# EAGLE design de1_breakout (EAGLE 6.5.0)
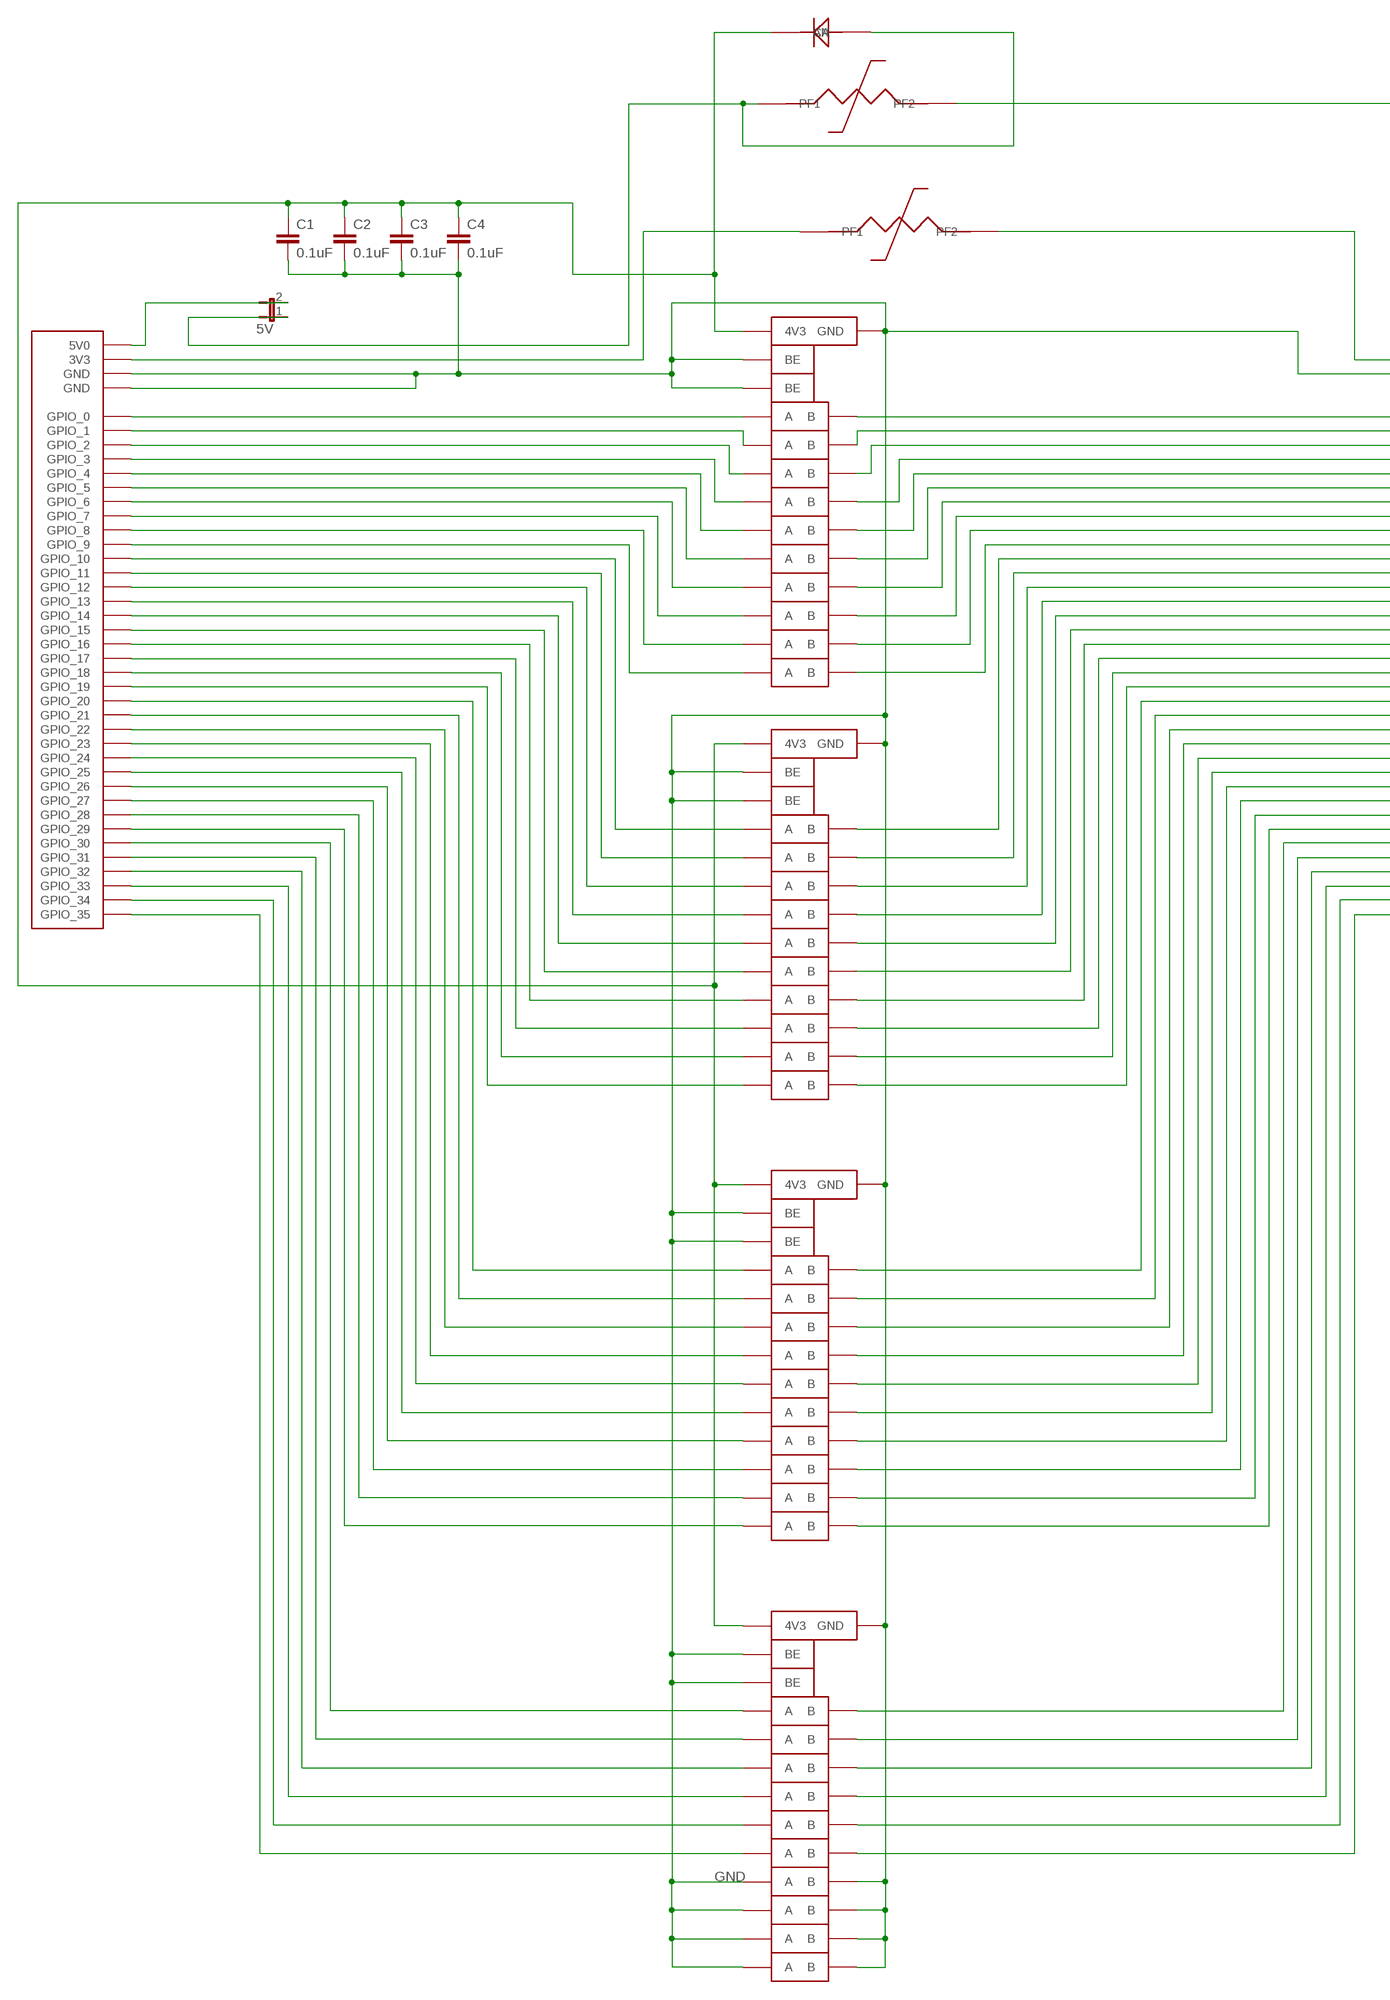
[diagram p0: schematic, sheet 1, part 1 of 2]
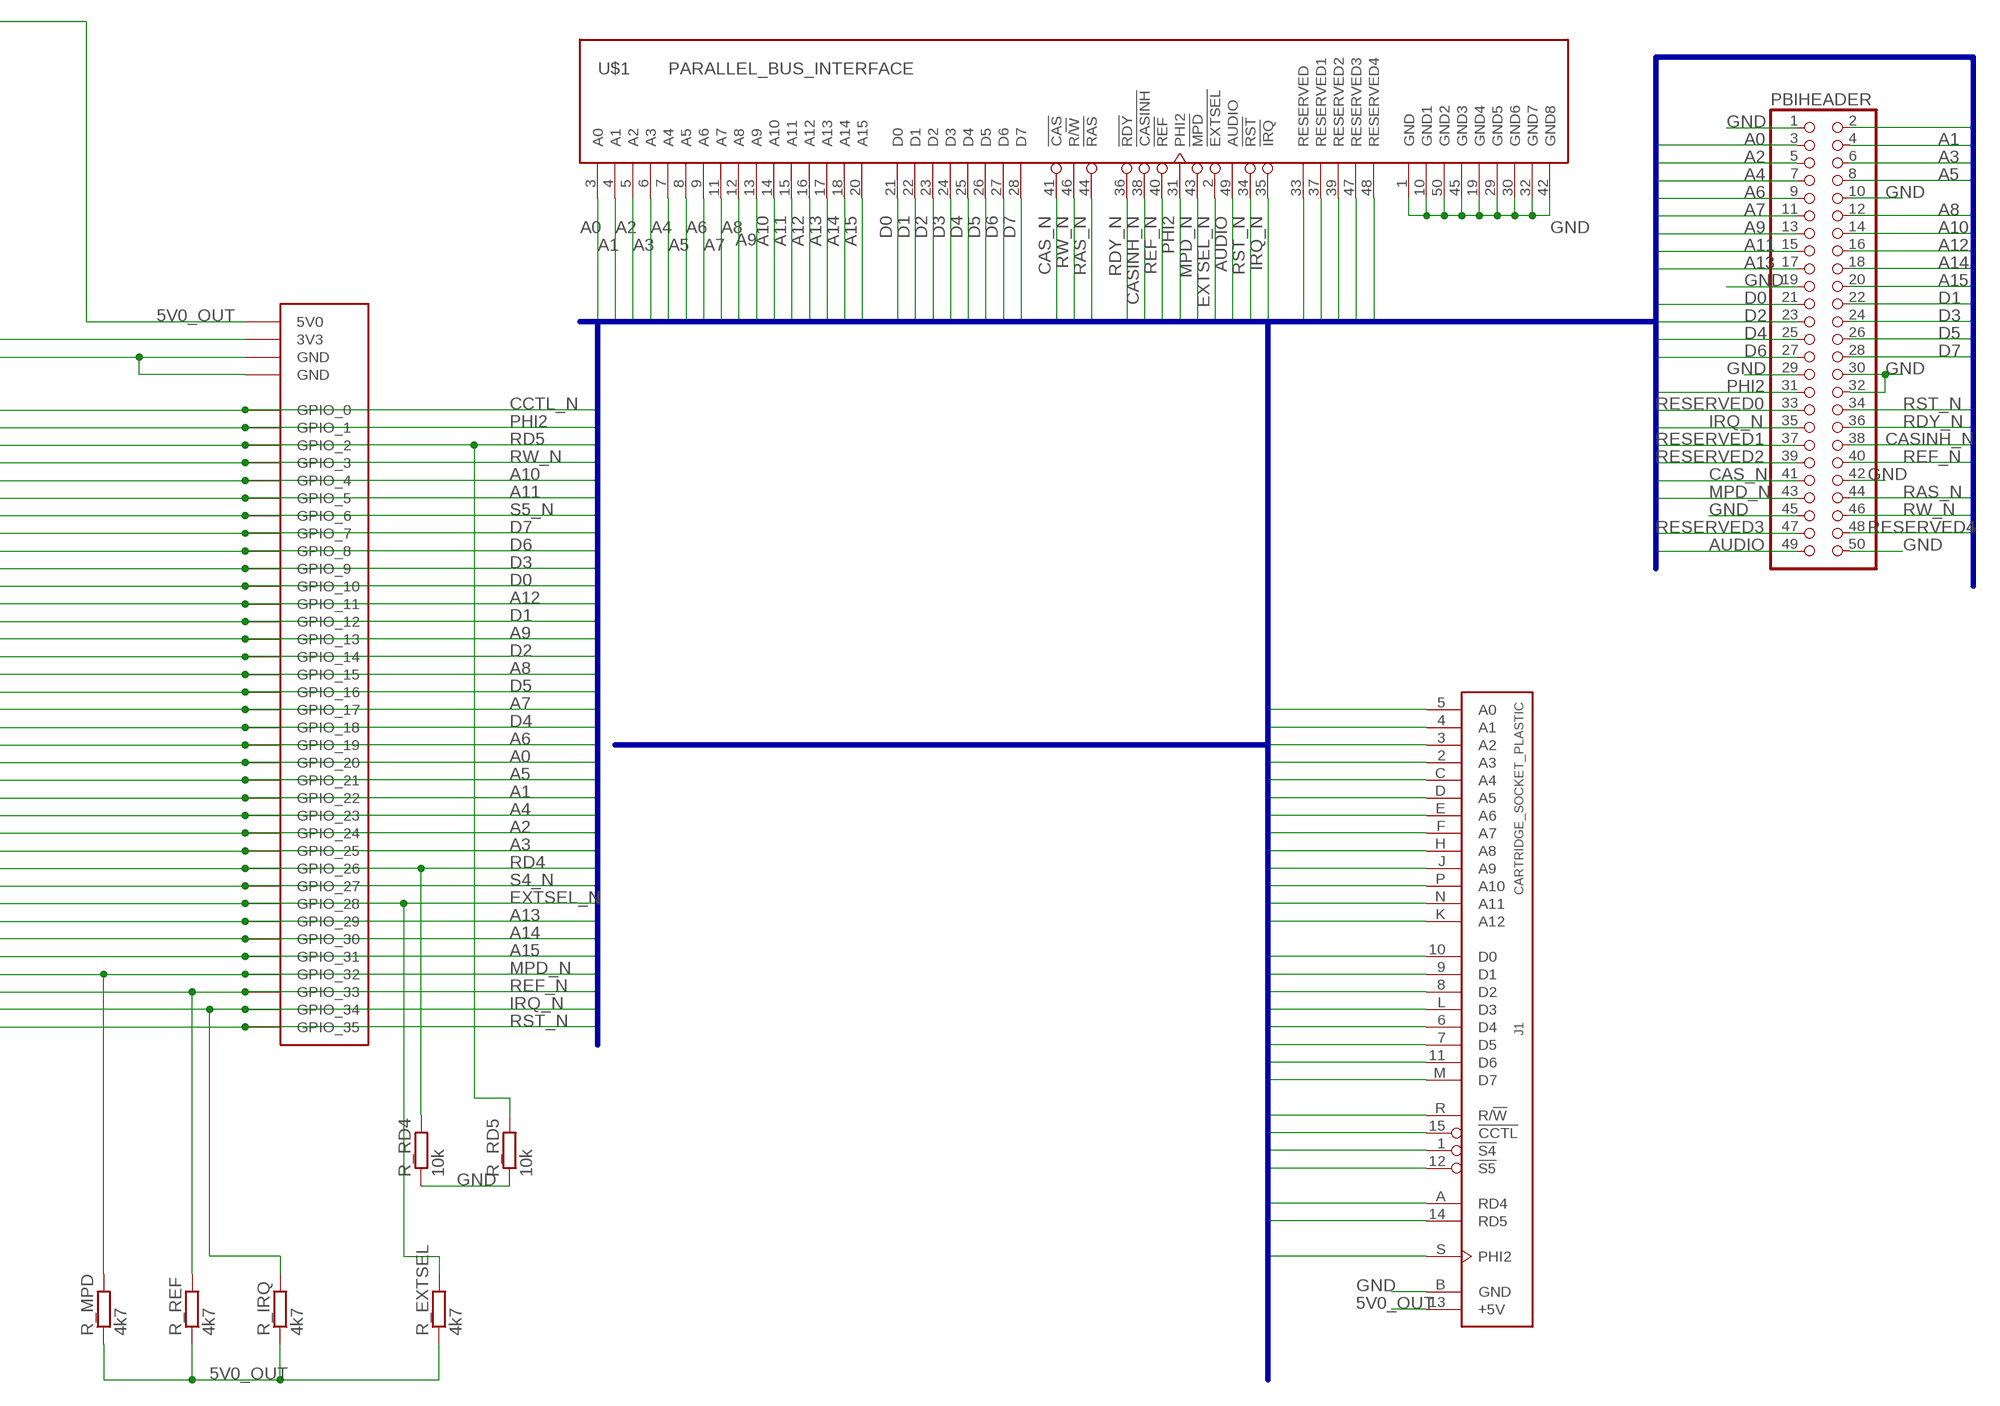
[diagram p1: schematic, sheet 1, part 2 of 2]

## Parts
1N4148  1N4148  [SOD123]
3VPOLY  POLYFUSE_1206  [C1206]
5V  JP1E  [JP1]
5VPOLY  POLYFUSE_1206  [C1206]
C1  0.1uF  C-EUC1206  [C1206]
C2  0.1uF  C-EUC1206  [C1206]
C3  0.1uF  C-EUC1206  [C1206]
C4  0.1uF  C-EUC1206  [C1206]
DE1_GPIO  DE1_GPIO  [DIL-100-2X20]
EXT_GPIO  DE1_GPIO_L  [DIL-100-2X20]
IC1  QS3384  [TSSOP24]
IC2  QS3384  [TSSOP24]
IC3  QS3384  [TSSOP24]
IC4  QS3384  [TSSOP24]
J1  CARTRIDGE_SOCKET_PLASTIC  [CARTRIDGE_SOCKET_WITH_PLASTIC]
PBIHEADER  PINHD-2X25  [2X25]
R_EXTSEL  4k7  R-EU_R1206  [R1206]
R_IRQ  4k7  R-EU_R1206  [R1206]
R_MPD  4k7  R-EU_R1206  [R1206]
R_RD4  10k  R-EU_R1206  [R1206]
R_RD5  10k  R-EU_R1206  [R1206]
R_REF  4k7  R-EU_R1206  [R1206]
U$1  PARALLEL_BUS_INTERFACE  [PARALLEL_BUS_INTERFACE]

## Nets
3V3_IN: 3VPOLY.1(PF1) DE1_GPIO.29(3V3)
3V3_OUT: 3VPOLY.2(PF2) EXT_GPIO.29(3V3)
4V3_INT: 1N4148.1(CA) C1.1 C2.1 C3.1 C4.1 IC1.24(4V3) IC2.24(4V3) IC3.24(4V3) IC4.24(4V3)
5V0_DE1: 5V.2 DE1_GPIO.11(5V0)
5V0_IN: 1N4148.2(AN) 5V.1 5VPOLY.1(PF1)
5V0_OUT: 5VPOLY.2(PF2) EXT_GPIO.11(5V0) J1.13(+5V) R_EXTSEL.1 R_IRQ.1 R_MPD.1 R_REF.1
A0: EXT_GPIO.23(GPIO_20) IC3.2(B) J1.5(A0) PBIHEADER.3 U$1.3(A0)
A1: EXT_GPIO.25(GPIO_22) IC3.6(B) J1.4(A1) PBIHEADER.4 U$1.4(A1)
A2: EXT_GPIO.27(GPIO_24) IC3.10(B) J1.3(A2) PBIHEADER.5 U$1.5(A2)
A3: EXT_GPIO.28(GPIO_25) IC3.15(B) J1.2(A3) PBIHEADER.6 U$1.6(A3)
A4: EXT_GPIO.26(GPIO_23) IC3.9(B) J1.C(A4) PBIHEADER.7 U$1.7(A4)
A5: EXT_GPIO.24(GPIO_21) IC3.5(B) J1.D(A5) PBIHEADER.8 U$1.8(A5)
A6: EXT_GPIO.22(GPIO_19) IC2.23(B) J1.E(A6) PBIHEADER.9 U$1.9(A6)
A7: EXT_GPIO.20(GPIO_17) IC2.19(B) J1.F(A7) PBIHEADER.11 U$1.11(A7)
A8: EXT_GPIO.18(GPIO_15) IC2.15(B) J1.H(A8) PBIHEADER.12 U$1.12(A8)
A9: EXT_GPIO.16(GPIO_13) IC2.9(B) J1.J(A9) PBIHEADER.13 U$1.13(A9)
A10: EXT_GPIO.5(GPIO_4) IC1.10(B) J1.P(A10) PBIHEADER.14 U$1.14(A10)
A11: EXT_GPIO.6(GPIO_5) IC1.15(B) J1.N(A11) PBIHEADER.15 U$1.15(A11)
A12: EXT_GPIO.14(GPIO_11) IC2.5(B) J1.K(A12) PBIHEADER.16 U$1.16(A12)
A13: EXT_GPIO.34(GPIO_29) IC3.23(B) PBIHEADER.17 U$1.17(A13)
A14: EXT_GPIO.35(GPIO_30) IC4.2(B) PBIHEADER.18 U$1.18(A14)
A15: EXT_GPIO.36(GPIO_31) IC4.5(B) PBIHEADER.20 U$1.20(A15)
AUDIO: PBIHEADER.49 U$1.49(AUDIO)
CAS_N: PBIHEADER.41 U$1.41(!CAS)
CASINH_N: PBIHEADER.38 U$1.38(!CASINH)
CCTL_N: EXT_GPIO.1(GPIO_0) IC1.2(B) J1.15(!CCTL)
D0: EXT_GPIO.13(GPIO_10) IC2.2(B) J1.10(D0) PBIHEADER.21 U$1.21(D0)
D1: EXT_GPIO.15(GPIO_12) IC2.6(B) J1.9(D1) PBIHEADER.22 U$1.22(D1)
D2: EXT_GPIO.17(GPIO_14) IC2.10(B) J1.8(D2) PBIHEADER.23 U$1.23(D2)
D3: EXT_GPIO.10(GPIO_9) IC1.23(B) J1.L(D3) PBIHEADER.24 U$1.24(D3)
D4: EXT_GPIO.21(GPIO_18) IC2.20(B) J1.6(D4) PBIHEADER.25 U$1.25(D4)
D5: EXT_GPIO.19(GPIO_16) IC2.16(B) J1.7(D5) PBIHEADER.26 U$1.26(D5)
D6: EXT_GPIO.9(GPIO_8) IC1.20(B) J1.11(D6) PBIHEADER.27 U$1.27(D6)
D7: EXT_GPIO.8(GPIO_7) IC1.19(B) J1.M(D7) PBIHEADER.28 U$1.28(D7)
EXTSEL_N: EXT_GPIO.33(GPIO_28) IC3.20(B) PBIHEADER.2 R_EXTSEL.2 U$1.2(!EXTSEL)
GND: C1.2 C2.2 C3.2 C4.2 DE1_GPIO.12(GND) DE1_GPIO.30(GND) EXT_GPIO.12(GND) EXT_GPIO.30(GND) IC1.1(BEA:BE) IC1.12(GND) IC1.13(BEB:BE) IC2.1(BEA:BE) IC2.12(GND) IC2.13(BEB:BE) IC3.1(BEA:BE) IC3.12(GND) IC3.13(BEB:BE) IC4.1(BEA:BE) IC4.12(GND) IC4.13(BEB:BE) IC4.16(B) IC4.17(A) IC4.18(A) IC4.19(B) IC4.20(B) IC4.21(A) IC4.22(A) IC4.23(B) J1.B(GND) PBIHEADER.1 PBIHEADER.10 PBIHEADER.19 PBIHEADER.29 PBIHEADER.30 PBIHEADER.32 PBIHEADER.42 PBIHEADER.45 PBIHEADER.50 R_RD4.1 R_RD5.1 U$1.1(GND) U$1.10(GND1) U$1.19(GND4) U$1.29(GND5) U$1.30(GND6) U$1.32(GND7) U$1.42(GND8) U$1.45(GND3) U$1.50(GND2)
IRQ_N: EXT_GPIO.39(GPIO_34) IC4.10(B) PBIHEADER.35 R_IRQ.2 U$1.35(!IRQ)
MPD_N: EXT_GPIO.37(GPIO_32) IC4.6(B) PBIHEADER.43 R_MPD.2 U$1.43(!MPD)
N$2: DE1_GPIO.1(GPIO_0) IC1.3(A)
N$3: DE1_GPIO.2(GPIO_1) IC1.4(A)
N$4: DE1_GPIO.3(GPIO_2) IC1.7(A)
N$5: DE1_GPIO.4(GPIO_3) IC1.8(A)
N$6: DE1_GPIO.5(GPIO_4) IC1.11(A)
N$7: DE1_GPIO.6(GPIO_5) IC1.14(A)
N$8: DE1_GPIO.7(GPIO_6) IC1.17(A)
N$9: DE1_GPIO.8(GPIO_7) IC1.18(A)
N$10: DE1_GPIO.9(GPIO_8) IC1.21(A)
N$11: DE1_GPIO.10(GPIO_9) IC1.22(A)
N$12: DE1_GPIO.13(GPIO_10) IC2.3(A)
N$13: DE1_GPIO.14(GPIO_11) IC2.4(A)
N$14: DE1_GPIO.15(GPIO_12) IC2.7(A)
N$15: DE1_GPIO.16(GPIO_13) IC2.8(A)
N$16: DE1_GPIO.17(GPIO_14) IC2.11(A)
N$17: DE1_GPIO.18(GPIO_15) IC2.14(A)
N$18: DE1_GPIO.19(GPIO_16) IC2.17(A)
N$19: DE1_GPIO.20(GPIO_17) IC2.18(A)
N$20: DE1_GPIO.21(GPIO_18) IC2.21(A)
N$21: DE1_GPIO.22(GPIO_19) IC2.22(A)
N$22: DE1_GPIO.23(GPIO_20) IC3.3(A)
N$23: DE1_GPIO.24(GPIO_21) IC3.4(A)
N$24: DE1_GPIO.25(GPIO_22) IC3.7(A)
N$25: DE1_GPIO.26(GPIO_23) IC3.8(A)
N$26: DE1_GPIO.27(GPIO_24) IC3.11(A)
N$27: DE1_GPIO.28(GPIO_25) IC3.14(A)
N$28: DE1_GPIO.31(GPIO_26) IC3.17(A)
N$29: DE1_GPIO.32(GPIO_27) IC3.18(A)
N$30: DE1_GPIO.33(GPIO_28) IC3.21(A)
N$31: DE1_GPIO.34(GPIO_29) IC3.22(A)
N$32: DE1_GPIO.37(GPIO_32) IC4.7(A)
N$33: DE1_GPIO.35(GPIO_30) IC4.3(A)
N$34: DE1_GPIO.36(GPIO_31) IC4.4(A)
N$35: DE1_GPIO.38(GPIO_33) IC4.8(A)
N$36: DE1_GPIO.39(GPIO_34) IC4.11(A)
N$37: DE1_GPIO.40(GPIO_35) IC4.14(A)
PHI2: EXT_GPIO.2(GPIO_1) IC1.5(B) J1.S(PHI2) PBIHEADER.31 U$1.31(PHI2)
RAS_N: PBIHEADER.44 U$1.44(!RAS)
RD4: EXT_GPIO.31(GPIO_26) IC3.16(B) J1.A(RD4) R_RD4.2
RD5: EXT_GPIO.3(GPIO_2) IC1.6(B) J1.14(RD5) R_RD5.2
RDY_N: PBIHEADER.36 U$1.36(!RDY)
REF_N: EXT_GPIO.38(GPIO_33) IC4.9(B) PBIHEADER.40 R_REF.2 U$1.40(!REF)
RESERVED0: PBIHEADER.33 U$1.33(RESERVED)
RESERVED1: PBIHEADER.37 U$1.37(RESERVED1)
RESERVED2: PBIHEADER.39 U$1.39(RESERVED2)
RESERVED3: PBIHEADER.47 U$1.47(RESERVED3)
RESERVED4: PBIHEADER.48 U$1.48(RESERVED4)
RST_N: EXT_GPIO.40(GPIO_35) IC4.15(B) PBIHEADER.34 U$1.34(!RST)
RW_N: EXT_GPIO.4(GPIO_3) IC1.9(B) J1.R(R/!W) PBIHEADER.46 U$1.46(R/!W)
S4_N: EXT_GPIO.32(GPIO_27) IC3.19(B) J1.1(!S4)
S5_N: EXT_GPIO.7(GPIO_6) IC1.16(B) J1.12(!S5)

## Buses
A[0..15],D[0..7],CAS_N,RW_N,RAS_N,RDY_N,CASINH_N,REF_N,PHI2,MPD_N,EXTSEL_N,AUDIO,RST_N,IRQ_N,CCTL_N,S4_N,S5_N,RD4,RD5,RESERVED[0..4]

## Library data of the parts
1N4148 = quickswitch:1N4148
3VPOLY 5VPOLY = quickswitch:POLYFUSE_1206
5V = jumper:JP1E: JUMPER
C1-C4 = rcl:C-EU: CAPACITOR, European symbol
DE1_GPIO = quickswitch:DE1_GPIO
EXT_GPIO = quickswitch:DE1_GPIO_L
IC1-IC4 = quickswitch:QS3384: IDT Quickswitch - 3.3V/5V conversion
J1 = atari:CARTRIDGE_SOCKET: Cartridge Socket
PBIHEADER = pinhead:PINHD-2X25: PIN HEADER
R_EXTSEL R_IRQ R_MPD R_RD4 R_RD5 R_REF = rcl:R-EU_: RESISTOR, European symbol
U$1 = atari:PARALLEL_BUS_INTERFACE: Parallel Bus Interface (Computer's Side)

## Board
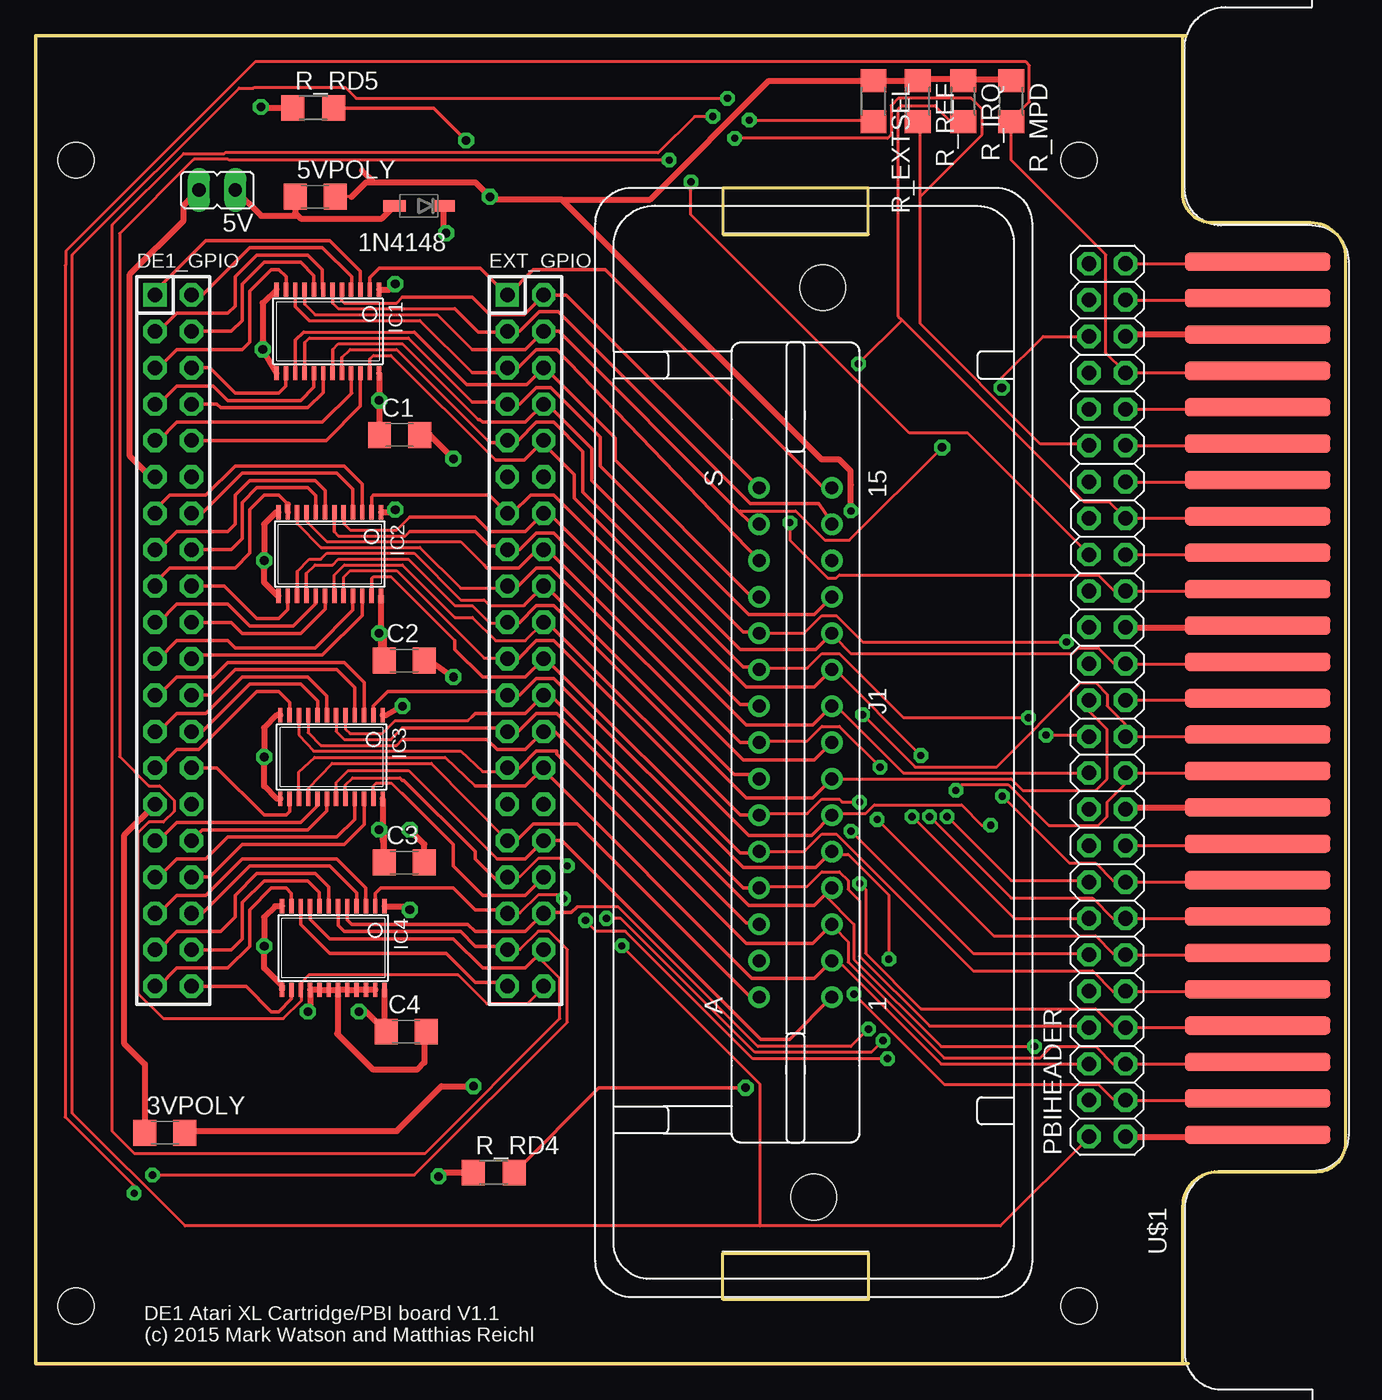
[diagram p2: board, top side]
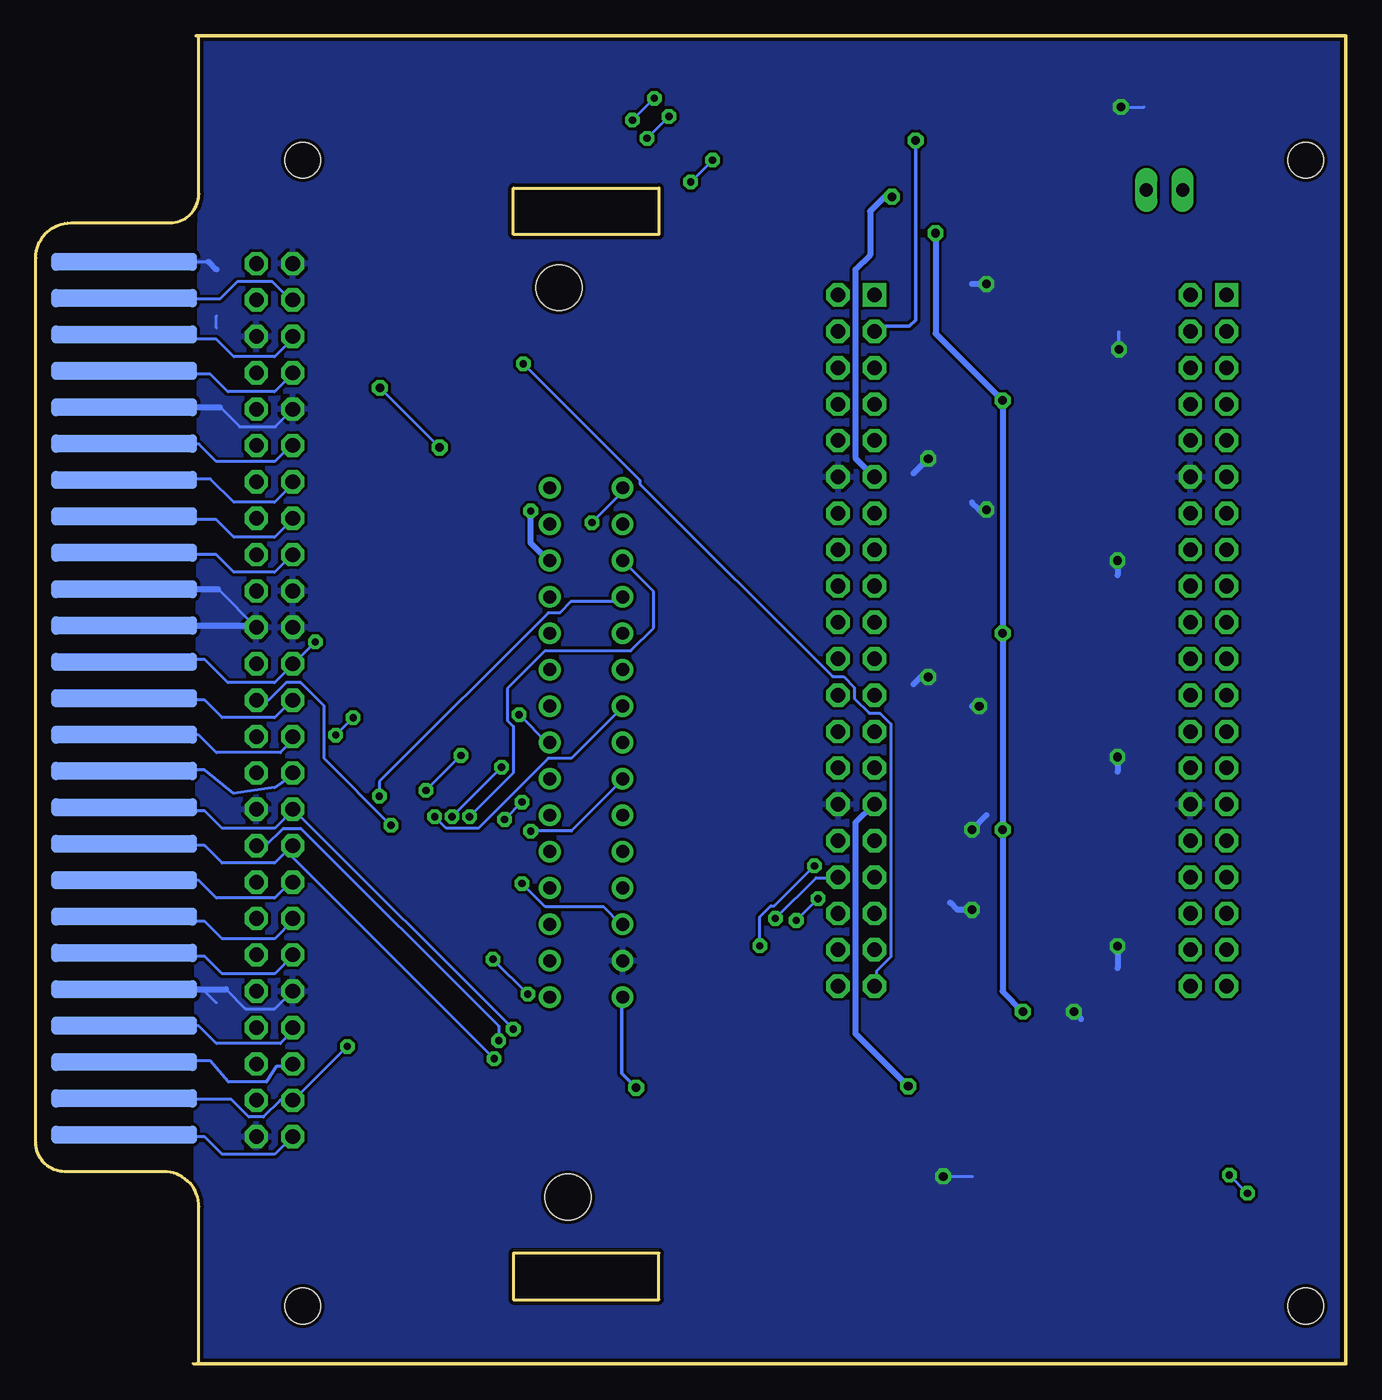
[diagram p3: board, bottom side, seen from below]

Size 91.44 x 92.72 mm. Coordinates in mm from the lower left corner, seen from the top.
Outline: 80.25,92.72 0,92.72 0,0 80.06,0
Outline: 80.25,0 80.06,0
Outline: 80.47,0 80.06,0
Outline: 80.06,0 80.06,10.97 arc-90 82.5,13.41 89.41,13.41 arc90 91.44,15.44 91.44,77.22 arc90 89,79.65 82.09,79.65 arc-90 80.06,81.69 80.06,92.66
Outline: 47.96,82.09 47.96,78.84 58.12,78.84 58.12,82.09 47.96,82.09
Outline: 47.96,7.72 58.12,7.72 58.12,4.47 47.96,4.47 47.96,7.72
Copper layers (1*16): Top 0.035mm / dielectric 1.5mm / Bottom 0.035mm
Design rules "sparkfun": minimum track width 8mil, minimum drill 20mil, track to track 8mil, track to pad 8mil, pad to pad 8mil, via to via 8mil, smd to smd 8mil, copper to edge 10mil, drill to drill 8mil, minimum pad ring 12mil, minimum via ring 10mil, stop-mask expansion 4mil, vias tented up to drill 25mil, thermal gap 10mil
Holes 2.5 mm at 2.8,84.03 2.8,4.03 72.8,4.03 72.8,84.03

### Footprints (pad centres in the part's own frame; a part is rotated, then mirrored left to right if it is on the bottom)
SOD123 = smd 1.6 x 0.8: 1 -1.7,0; 2 1.7,0
C1206 = smd 1.6 x 1.8: 1 -1.4,0; 2 1.4,0
JP1 = drill 0.914 long: 1 0,-1.27; 2 0,1.27
DIL-100-2X20 = drill 1.016 square: 1 -24.13,-1.27 | drill 1.016 octagon: 2 -24.13,1.27; 3 -21.59,-1.27; 4 -21.59,1.27; 5 -19.05,-1.27; 6 -19.05,1.27; 7 -16.51,-1.27; 8 -16.51,1.27; 9 -13.97,-1.27; 10 -13.97,1.27; 11 -11.43,-1.27; 12 -11.43,1.27; 13 -8.89,-1.27; 14 -8.89,1.27; 15 -6.35,-1.27; 16 -6.35,1.27; 17 -3.81,-1.27; 18 -3.81,1.27; 19 -1.27,-1.27; 20 -1.27,1.27; 21 1.27,-1.27; 22 1.27,1.27; 23 3.81,-1.27; 24 3.81,1.27; 25 6.35,-1.27; 26 6.35,1.27; 27 8.89,-1.27; 28 8.89,1.27; 29 11.43,-1.27; 30 11.43,1.27; 31 13.97,-1.27; 32 13.97,1.27; 33 16.51,-1.27; 34 16.51,1.27; 35 19.05,-1.27; 36 19.05,1.27; 37 21.59,-1.27; 38 21.59,1.27; 39 24.13,-1.27; 40 24.13,1.27
TSSOP24 = smd 0.305 x 0.991: 1 -3.575,-2.918; 2 -2.925,-2.918; 3 -2.275,-2.918; 4 -1.625,-2.918; 5 -0.975,-2.918; 6 -0.325,-2.918; 7 0.325,-2.918; 8 0.975,-2.918; 9 1.625,-2.918; 10 2.275,-2.918; 11 2.925,-2.918; 12 3.575,-2.918; 13 3.575,2.918; 14 2.925,2.918; 15 2.275,2.918; 16 1.625,2.918; 17 0.975,2.918; 18 0.325,2.918; 19 -0.325,2.918; 20 -0.975,2.918; 21 -1.625,2.918; 22 -2.275,2.918; 23 -2.925,2.918; 24 -3.575,2.918
CARTRIDGE_SOCKET_WITH_PLASTIC = drill 0.9: 1 17.78,2.54; 2 15.24,2.54; 3 12.7,2.54; 4 10.16,2.54; 5 7.62,2.54; 6 5.08,2.54; 7 2.54,2.54; 8 0,2.54; 9 -2.54,2.54; 10 -5.08,2.54; 11 -7.62,2.54; 12 -10.16,2.54; 13 -12.7,2.54; 14 -15.24,2.54; 15 -17.78,2.54; A 17.78,-2.54; B 15.24,-2.54; C 12.7,-2.54; D 10.16,-2.54; E 7.62,-2.54; F 5.08,-2.54; H 2.54,-2.54; J 0,-2.54; K -2.54,-2.54; L -5.08,-2.54; M -7.62,-2.54; N -10.16,-2.54; P -12.7,-2.54; R -15.24,-2.54; S -17.78,-2.54 | hole 3.2: -31.75,1.905; 31.75,1.27
2X25 = drill 1.016 octagon: 1 -30.48,-1.27; 2 -30.48,1.27; 3 -27.94,-1.27; 4 -27.94,1.27; 5 -25.4,-1.27; 6 -25.4,1.27; 7 -22.86,-1.27; 8 -22.86,1.27; 9 -20.32,-1.27; 10 -20.32,1.27; 11 -17.78,-1.27; 12 -17.78,1.27; 13 -15.24,-1.27; 14 -15.24,1.27; 15 -12.7,-1.27; 16 -12.7,1.27; 17 -10.16,-1.27; 18 -10.16,1.27; 19 -7.62,-1.27; 20 -7.62,1.27; 21 -5.08,-1.27; 22 -5.08,1.27; 23 -2.54,-1.27; 24 -2.54,1.27; 25 0,-1.27; 26 0,1.27; 27 2.54,-1.27; 28 2.54,1.27; 29 5.08,-1.27; 30 5.08,1.27; 31 7.62,-1.27; 32 7.62,1.27; 33 10.16,-1.27; 34 10.16,1.27; 35 12.7,-1.27; 36 12.7,1.27; 37 15.24,-1.27; 38 15.24,1.27; 39 17.78,-1.27; 40 17.78,1.27; 41 20.32,-1.27; 42 20.32,1.27; 43 22.86,-1.27; 44 22.86,1.27; 45 25.4,-1.27; 46 25.4,1.27; 47 27.94,-1.27; 48 27.94,1.27; 49 30.48,-1.27; 50 30.48,1.27
R1206 = smd 1.6 x 1.803: 1 -1.422,0; 2 1.422,0
PARALLEL_BUS_INTERFACE = smd 1.27 x 10.16: 1 30.48,1.27; 3 27.94,1.27; 5 25.4,1.27; 7 22.86,1.27; 9 20.32,1.27; 11 17.78,1.27; 13 15.24,1.27; 15 12.7,1.27; 17 10.16,1.27; 19 7.62,1.27; 21 5.08,1.27; 23 2.54,1.27; 25 0,1.27; 27 -2.54,1.27; 29 -5.08,1.27; 31 -7.62,1.27; 33 -10.16,1.27; 35 -12.7,1.27; 37 -15.24,1.27; 39 -17.78,1.27; 41 -20.32,1.27; 43 -22.86,1.27; 45 -25.4,1.27; 47 -27.94,1.27; 49 -30.48,1.27 | smd 1.27 x 10.16 bottom: 2 30.48,1.27; 4 27.94,1.27; 6 25.4,1.27; 8 22.86,1.27; 10 20.32,1.27; 12 17.78,1.27; 14 15.24,1.27; 16 12.7,1.27; 18 10.16,1.27; 20 7.62,1.27; 22 5.08,1.27; 24 2.54,1.27; 26 0,1.27; 28 -2.54,1.27; 30 -5.08,1.27; 32 -7.62,1.27; 34 -10.16,1.27; 36 -12.7,1.27; 38 -15.24,1.27; 40 -17.78,1.27; 42 -20.32,1.27; 44 -22.86,1.27; 46 -25.4,1.27; 48 -27.94,1.27; 50 -30.48,1.27

### Placement (x,y rotation side)
1N4148  26.74,80.84 180 top
3VPOLY  9.01,16.12 0 top
5V  12.66,81.95 90 top
5VPOLY  19.5,81.48 0 top
C1  25.39,64.84 0 top
C2  25.72,49.09 0 top
C3  25.72,34.99 0 top
C4  25.85,23.18 0 top
DE1_GPIO  9.59,50.49 270 top
EXT_GPIO  34.18,50.49 270 top
IC1  20.39,72.08 180 top
IC2  20.51,56.53 180 top
IC3  20.64,42.36 180 top
IC4  20.77,29.03 180 top
J1  53.02,43.38 270 top
PBIHEADER  74.78,46.33 90 top
R_EXTSEL  58.47,88.15 270 top
R_IRQ  64.74,88.15 270 top
R_MPD  68.08,88.15 270 top
R_RD4  31.96,13.34 0 top
R_RD5  19.37,87.68 0 top
R_REF  61.55,88.15 270 top
U$1  84.01,46.46 270 top

### Tracks (layer width: path | path; a pad name or v marks a point on that pad's centre or on a via)
3V3_IN
  Top 0.406: DE1_GPIO.29 6.19,36.93 6.19,22.32 7.61,20.9 3VPOLY.1
3V3_OUT  (via drill 0.6)
  Top 0.406: 3VPOLY.2 10.54,16.26 25.2,16.26 28.32,19.37 v30.55,19.37
  Bottom 0.406: EXT_GPIO.29 32.96,39.06 34.23,37.79 34.23,23.06 v30.55,19.37
4V3_INT  (via drill 0.6)
  Top 0.406: IC2.24 24.09,49.32 C2.1 24.32,50.64 v23.96,51 | IC3.24 24.22,36.62 C3.1 24.32,36.92 v23.96,37.28 | 1N4148.1 28.44,79.14 v28.64,78.94 | v22.55,24.58 23.05,24.58 24.34,23.29 | 24.34,23.29 C4.1 | 24.34,23.29 IC4.24 | C1.1 23.96,64.87 v23.96,67.25 IC1.24
  Bottom 0.406: v28.64,78.94 28.64,71.93 v23.96,67.25 v23.96,51 v23.96,37.28 23.96,26 v22.55,24.58
5V0_DE1
  Top 0.406: 8.31,61.92 DE1_GPIO.11 8.01,61.92 6.56,63.36 6.56,76.06 10.32,79.82 10.32,80.89 5V.2
5V0_IN
  Top 0.406: 24.45,80.84 1N4148.2 24.15,79.95 18.48,79.95 18.38,80.05 18.28,80.16 | 5VPOLY.1 18.1,80.34 18.28,80.16 | 5V.1 15.73,80.16 18.28,80.16
5V0_OUT  (via drill 0.51, 0.6)
  Top 0.203: 5VPOLY.2 20.93,81.48 21.95,81.48 22.04,81.48 | 31.7,81.28 v31.69,81.48
  Top 0.406: 22.04,81.48 23.05,82.49 23.57,82.49 | 23.57,82.49 30.67,82.49 v31.69,81.48 | 22.75,83.31 23.57,82.49 | 36.7,81.28 31.7,81.28 | v56.9,59.54 56.9,61.37 56.86,61.41 56.86,62.35 56.04,63.16 54.82,63.16 36.7,81.28 | 36.7,81.28 42.87,81.28 51.17,89.57 R_EXTSEL.1 R_REF.1 | 60.92,89.57 61.02,89.68 61.45,89.68 R_REF.1 | R_REF.1 61.65,89.68 64.68,89.68 64.74,89.62 R_IRQ.1 64.74,89.63 64.78,89.68 67.98,89.68 R_MPD.1
  Bottom 0.203: 55.68,56.08 J1.13
  Bottom 0.406: v31.69,81.48 32.2,81.48 33.21,80.46 33.21,77.41 34.23,76.4 34.23,63.24 EXT_GPIO.11 | v56.9,59.54 56.9,57.3 55.68,56.08
A0  (via drill 0.51)
  Top 0.203: U$1.3 85.14,18.39 PBIHEADER.3 76,18.49 75.18,18.49 74.17,19.51 63.4,19.51 v57.1,25.81 | v59.54,28.25 59.54,32.72 56.69,35.56 55.68,35.56 J1.5
  Top 0.254: IC3.2 23.57,45.92 24.58,46.93 32.65,46.93 EXT_GPIO.23 33.77,46.68 34.94,47.85 36.16,47.85 49.37,34.64 54.45,34.64 J1.5
  Bottom 0.203: v59.54,28.25 v57.1,25.81
A1  (via drill 0.51)
  Top 0.203: IC3.6 20.97,44.14 21.53,43.58 24.78,43.58 25.59,44.39 | v69.7,22.15 63.2,22.15 57.1,28.25 57.1,30.68 55.07,32.72 J1.4
  Top 0.254: 25.59,44.39 32.65,44.39 EXT_GPIO.25 33.67,44.14 34.94,45.41 36.36,45.41 49.77,32 54.35,32 J1.4
  Bottom 0.203: PBIHEADER.4 73.51,18.34 | v69.7,22.15 73.36,18.49 PBIHEADER.4 | PBIHEADER.4 74.4,18.39 75.55,17.24 76.57,17.24 77.79,18.45 85.21,18.45 U$1.4
A2
  Top 0.203: IC3.10 18.37,43.9 19.4,42.77 29.66,42.77 31.18,41.35 32.65,41.35 EXT_GPIO.27 | U$1.5 85.14,20.93 PBIHEADER.5 75.18,20.93 73.97,22.15 70.92,22.15 70.1,21.34 63.4,21.34 56.69,28.04 56.69,29.46 55.68,30.48 J1.3
  Top 0.254: EXT_GPIO.27 33.77,41.6 34.94,42.77 36.36,42.77 36.36,42.56 49.57,29.36 54.24,29.36 J1.3
A3
  Top 0.203: IC3.15 18.37,41.33 19.47,42.33 28.57,42.33 30.67,40.33 | PBIHEADER.6 63.2,20.93 56.08,28.04 55.68,28.04 J1.2
  Top 0.254: 30.67,40.33 34.18,40.33 EXT_GPIO.28 35.45,41.45 49.98,26.92 54.35,26.92 J1.2
  Bottom 0.203: PBIHEADER.6 73.51,20.78 74.65,20.78 75.35,19.67 77.99,19.67 79.25,21.13 85.21,21.13 U$1.6
A4  (via drill 0.51)
  Top 0.203: IC3.9 19.02,44.06 19.9,43.17 25.19,43.17 25.59,43.58 | U$1.7 85.14,23.47 PBIHEADER.7 76,23.57 75.18,23.57 73.97,24.79 61.77,24.79 57.91,28.65 57.91,33.12 v57.51,33.53
  Top 0.254: 25.59,43.58 31.49,43.58 32.2,42.87 34.18,42.87 EXT_GPIO.26 36.21,44.14 49.57,30.78 50.38,30.78 J1.C
  Bottom 0.203: v57.51,33.53 55.88,31.9 51.82,31.9 50.6,30.68 J1.C
A5
  Top 0.203: IC3.5 21.62,44.31 21.94,43.99 24.17,43.99 25.09,44.9 30.17,44.9 30.47,45.21 | 73.36,23.57 PBIHEADER.8 73.41,23.57 62.38,23.57 57.51,28.45 57.51,32.31 56.69,33.12 56.69,33.73 56.08,34.34 54.86,34.34 53.85,33.33 50.6,33.33 J1.D
  Top 0.254: 30.47,45.21 30.67,45.41 34.18,45.41 EXT_GPIO.24 35.91,46.68 49.37,33.22 J1.D
  Bottom 0.203: PBIHEADER.8 73.51,23.22 74.37,22.35 78.84,22.35 80.06,23.57 85.24,23.57 U$1.8
A6
  Top 0.203: 23.44,54.84 23.56,54.96 24.78,54.96 29.25,50.49 | U$1.9 85.14,26.01 PBIHEADER.9 75.18,26.01 73.76,27.43 65.43,27.43 55.88,36.98 54.86,36.98 53.65,35.76 50.6,35.76 J1.E
  Top 0.254: IC2.23 23.44,54.84 | 29.25,50.49 29.25,49.88 31.18,47.95 34.18,47.95 EXT_GPIO.22 35.6,49.22 49.16,35.66 50.38,35.66 J1.E
A7  (via drill 0.51)
  Top 0.203: IC2.19 20.84,55.08 21.53,55.77 25.59,55.77 29.25,52.11 30.47,52.11 32.1,50.49 34.18,50.49 EXT_GPIO.20 | U$1.11 85.14,28.55 PBIHEADER.11 76,28.65 75.18,28.65 73.97,29.87 66.85,29.87 v58.73,38 | v57.51,39.22 56.29,39.22 56.08,39.42 54.86,39.42 53.85,38.41 50.6,38.41 J1.F
  Top 0.254: EXT_GPIO.20 35.7,51.76 49.16,38.3 J1.F
  Bottom 0.203: v57.51,39.22 v58.73,38
A8  (via drill 0.51)
  Top 0.203: 18.24,55.33 19.09,56.18 19.9,56.18 20.31,56.59 26.41,56.59 29.66,53.33 31.28,53.33 31.69,52.93 34.08,52.93 34.18,53.03 | v56.9,37.19 65.43,28.65 73.36,28.65 PBIHEADER.12
  Top 0.254: IC2.15 18.24,55.33 | 34.18,53.03 EXT_GPIO.18 35.6,54.3 48.76,41.14 50.18,41.14 J1.H
  Bottom 0.203: PBIHEADER.12 73.51,28.5 74.78,27.23 78.44,27.23 79.65,28.45 85.04,28.45 U$1.12 | v56.9,37.19 54.05,37.19 50.6,40.64 J1.H
A9  (via drill 0.51)
  Top 0.203: IC2.9 18.89,58.82 20.31,57.4 29.66,57.4 31.28,55.77 | U$1.13 85.14,31.09 PBIHEADER.13 75.18,31.09 73.76,32.51 68.07,32.51 v62.38,38.2 | v58.93,41.66 56.08,44.5 54.86,44.5 53.85,43.49 50.6,43.49 J1.J
  Top 0.254: 31.28,55.77 31.49,55.57 33.72,55.57 34.99,56.84 EXT_GPIO.16 35.7,56.84 49.16,43.38 J1.J
  Bottom 0.203: v58.93,41.66 v62.38,38.2
A10  (via drill 0.51)
  Top 0.203: 19.09,72.84 26.81,72.84 30.47,69.18 | PBIHEADER.14 68.28,31.09 v61.16,38.2
  Top 0.254: IC1.10 18.11,73.82 19.09,72.84 | 30.47,69.18 32.55,69.18 EXT_GPIO.5 33.67,69.54 34.94,70.81 36.36,70.81 J1.P
  Bottom 0.203: PBIHEADER.14 73.51,30.94 74.78,29.67 78.44,29.67 79.65,30.89 84.94,30.89 U$1.14 | v61.16,38.2 58.12,41.25 58.12,44.5 58.52,44.91 58.52,47.14 55.88,49.78 49.91,49.78 48.32,51.37 48.32,53.91 J1.P 50.6,55.88
A11  (via drill 0.51)
  Top 0.203: 18.68,72.03 26.41,72.03 | U$1.15 85.14,33.63 PBIHEADER.15 76,33.73 75.18,33.73 73.97,34.95 72.14,34.95 v67.46,39.62 | 50.8,53.24 50.6,53.44 J1.N
  Top 0.254: IC1.15 18.11,71.46 18.68,72.03 | 26.41,72.03 30.06,68.37 34.28,68.37 EXT_GPIO.6 35.85,69.18 40.43,64.61 40.43,63.09 49.98,53.54 J1.N
  Bottom 0.203: v67.46,39.62 67.46,40.64 55.68,52.43 54.86,52.43 54.05,53.24 50.78,53.24 J1.N
A12  (via drill 0.51)
  Top 0.203: 21.53,58.62 21.94,58.21 25.19,58.21 26.1,59.13 | v63.6,38.2 68.07,33.73 73.36,33.73 PBIHEADER.16
  Top 0.254: IC2.5 21.53,59.41 21.53,58.62 | 26.1,59.13 30.67,59.13 31.69,58.11 34.18,58.11 EXT_GPIO.14 35.8,59.38 49.16,46.02 50.38,46.02 J1.K
  Bottom 0.203: PBIHEADER.16 73.66,33.63 74.78,32.51 78.84,32.51 80.06,33.73 85.24,33.73 U$1.16 | v63.6,38.2 62.79,37.39 60.55,37.39 55.68,42.27 54.05,42.27 50.6,45.72 J1.K
A13  (via drill 0.51)
  Top 0.203: IC3.23 23.57,40.33 23.73,40.5 24.85,40.5 25.53,39.82 25.59,39.82 | PBIHEADER.17 85.14,36.17 U$1.17 | v39.83,31.09 40.84,31.09 50.19,21.74 58.32,21.74 v59.13,22.56
  Top 0.254: 25.59,39.82 29.15,36.27 29.15,34.74 31.18,32.71 34.18,32.71 EXT_GPIO.34
  Bottom 0.203: v39.83,31.09 36.98,33.93 35.56,33.93 EXT_GPIO.34 | v59.13,22.56 59.13,23.57 72.95,37.39 74.17,37.39 75.39,36.17 PBIHEADER.17
A14  (via drill 0.51)
  Top 0.203: v36.84,32.48 36.59,32.73 35.06,32.73 33.79,31.46 33.03,31.46 EXT_GPIO.35 | v38.36,30.95 39.13,30.19 41.16,30.19 50.05,21.3 v59.45,21.3
  Top 0.254: IC4.2 23.69,32.84 24.07,33.22 29.15,33.22 30.67,31.69 32.65,31.69 EXT_GPIO.35
  Bottom 0.203: PBIHEADER.18 73.56,36.17 73.97,35.76 | 73.97,35.76 74.78,34.95 78.44,34.95 79.65,36.17 85.14,36.17 U$1.18 | 73.97,35.76 PBIHEADER.18 | v38.36,30.95 v36.84,32.48 | v59.45,21.3 73.92,35.78 PBIHEADER.18
A15  (via drill 0.51)
  Top 0.203: 37.8,31.9 40.64,31.9 50.39,22.15 56.9,22.15 v58.12,23.37
  Top 0.254: IC4.5 21.74,30.97 22.04,30.68 30.17,30.68 30.67,30.17 34.18,30.17 EXT_GPIO.36 35.51,31.5 37.39,31.5 37.8,31.9
  Bottom 0.203: U$1.20 85.04,38.61 79.65,38.61 78.44,37.39 74.78,37.39 73.51,38.66 PBIHEADER.20 73.36,38.61 v58.12,23.37
AUDIO
  Top 0.203: PBIHEADER.49 85.14,76.81 U$1.49
CAS_N
  Top 0.203: PBIHEADER.41 85.14,66.65 U$1.41
CASINH_N
  Bottom 0.203: PBIHEADER.38 73.51,61.42 74.78,60.15 77.62,60.15 79.25,61.77 85.21,61.77 U$1.38
CCTL_N
  Top 0.254: IC1.2 23.31,75.84 23.97,76.5 31.03,76.5 EXT_GPIO.1 32.96,74.62 34.74,76.4 39.76,76.4 54.82,61.33 55.39,61.33 J1.15
D0  (via drill 0.51)
  Top 0.203: U$1.21 85.14,41.25 PBIHEADER.21 76,41.25 76,40.44 74.78,39.22 74.78,38.2 74.17,37.59 70.71,37.59 67.87,40.44 64.62,40.44 v64.21,40.03 | v61.77,42.47 55.68,48.57 J1.10
  Top 0.254: IC2.2 23.44,60.53 23.56,60.65 31.64,60.65 EXT_GPIO.13 33.26,59.38 34.53,60.65 36.16,60.65 49.57,47.24 54.35,47.24 J1.10
  Bottom 0.203: v61.77,42.47 v64.21,40.03
D1
  Top 0.203: 20.84,58.09 21.12,57.8 25.8,57.8 26.1,58.11 | PBIHEADER.22 60.55,41.25 56.08,45.72 55.68,45.72 J1.9
  Top 0.254: IC2.6 20.84,58.09 | 26.1,58.11 30.67,58.11 31.69,57.09 32.65,57.09 EXT_GPIO.15 33.77,56.84 34.94,58.01 36.16,58.01 49.57,44.6 54.24,44.6 J1.9
  Bottom 0.203: PBIHEADER.22 73.51,41.1 74.78,40.23 77.62,39.83 79.65,41.45 85.21,41.45 U$1.22
D2  (via drill 0.51)
  Top 0.203: IC2.10 18.24,58.66 19.9,56.99 26.81,56.99 29.66,54.15 32.76,54.15 EXT_GPIO.17 | U$1.23 85.14,43.79 PBIHEADER.23 76,43.89 76,44.7 74.78,45.92 74.78,46.74 73.97,47.55 72.95,47.55 67.06,41.66 61.37,41.66 v57.71,45.31
  Top 0.254: EXT_GPIO.17 33.67,54.3 34.94,55.57 35.96,55.57 49.37,42.16 54.35,42.16 J1.8
  Bottom 0.203: v57.71,45.31 55.68,43.28 J1.8
D3  (via drill 0.51)
  Top 0.203: 23.31,70.15 23.56,70.4 24.78,70.4 32.1,63.09 | v70.51,43.89 73.36,43.89 PBIHEADER.24 | v69.29,45.11 60.55,45.11 56.08,49.58 54.86,49.58 53.85,48.57 50.6,48.57 J1.L
  Top 0.254: IC1.23 23.31,70.15 | 32.1,63.09 34.08,63.09 EXT_GPIO.10 35.45,64.21 37.58,62.07 37.58,60.45 49.37,48.66 50.28,48.66 J1.L
  Bottom 0.203: PBIHEADER.24 73.51,43.54 74.37,42.67 78.84,42.67 80.06,43.89 85.24,43.89 U$1.24 | v69.29,45.11 v70.51,43.89
D4  (via drill 0.51)
  Top 0.203: IC2.20 21.49,54.92 21.94,55.37 25.19,55.37 31.28,49.27 32.86,49.27 EXT_GPIO.21 | PBIHEADER.25 85.14,46.33 U$1.25 | v66.65,37.59 66.04,37.59 64.62,39.01 58.52,39.01 57.91,38.41 55.68,38.41 J1.6
  Top 0.254: EXT_GPIO.21 33.67,49.22 34.94,50.49 36.16,50.49 49.77,36.87 54.14,36.87 J1.6
  Bottom 0.203: PBIHEADER.25 75.18,46.33 73.97,47.55 72.95,47.55 71.32,45.92 71.32,42.27 v66.65,37.59
D5
  Top 0.203: 18.89,55.16 19.5,55.77 20.72,55.77 21.12,56.18 26,56.18 29.25,52.93 30.47,52.93 31.69,51.71 32.86,51.71 EXT_GPIO.19 | PBIHEADER.26 73.56,46.33 73.56,45.52 74.78,44.3 74.78,40.84 73.97,40.03 68.89,40.03 68.07,40.84 55.68,40.84 J1.7
  Top 0.254: IC2.16 18.89,55.16 | EXT_GPIO.19 33.77,51.76 34.94,52.93 36.16,52.93 49.57,39.52 54.24,39.52 J1.7
  Bottom 0.203: PBIHEADER.26 73.56,46.33 74.78,45.11 78.44,45.11 79.65,46.33 85.14,46.33 U$1.26
D6
  Top 0.203: 21.36,70.23 21.94,70.81 25.19,70.81 31.69,64.31 | U$1.27 85.14,48.87 PBIHEADER.27 76,48.97 75.18,48.97 74.17,49.99 72.75,49.99 72.34,49.58 56.9,49.58 55.68,50.8 J1.11
  Top 0.254: IC1.20 21.36,70.23 | 31.69,64.31 32.76,64.31 EXT_GPIO.9 33.67,64.46 34.94,65.73 36.16,65.73 38.19,63.7 38.19,60.85 49.16,49.88 54.45,49.88 J1.11
D7  (via drill 0.51)
  Top 0.203: 20.71,70.8 21.12,71.22 25.59,71.22 30.88,65.93 | v71.93,50.39 57.71,50.39 55.88,52.22 54.86,52.22 53.65,51 50.6,51 J1.M
  Top 0.254: IC1.19 20.71,70.8 | 30.88,65.93 30.98,65.93 31.18,65.73 34.18,65.73 EXT_GPIO.8 35.7,67 38.8,63.9 38.8,61.67 49.37,51.1 50.38,51.1 J1.M
  Bottom 0.203: U$1.28 85.1,49.17 79.65,49.17 78.03,47.55 74.78,47.55 73.51,48.82 PBIHEADER.28 73.36,48.97 v71.93,50.39
EXTSEL_N  (via drill 0.51)
  Top 0.203: IC3.20 21.62,40.42 | 21.62,40.42 | 21.62,40.42 22.11,40.91 25.42,40.91 25.59,40.74 | v49.79,86.83 58.43,86.83 R_EXTSEL.2 | v48.27,88.36 22.36,88.36 21.6,89.12 15.25,89.12 15.2,89.07 14.18,89.07 2.55,77.43 2.55,17.49 10.42,9.62 50.56,9.62 | 50.56,9.62 67.32,9.62 73.42,15.71 PBIHEADER.2 | v37.09,34.76 36.59,35.27 35.06,35.27 33.79,34 33.03,34 EXT_GPIO.33 | v40.9,29.17 50.56,19.52 50.56,9.62
  Top 0.254: 25.59,40.74 25.69,40.74 30.67,35.76 30.67,35.25 32.2,33.73 32.65,33.73 EXT_GPIO.33
  Bottom 0.203: PBIHEADER.2 73.56,15.85 74.78,14.63 78.44,14.63 79.65,15.85 85.14,15.85 U$1.2 | v48.27,88.36 v49.79,86.83 | v37.09,34.76 39.89,31.97 40.14,31.97 40.9,31.21 v40.9,29.17
GND  (via drill 0.6)
  Top 0.203: 85.14,15.85 U$1.1 | 76.18,71.86 PBIHEADER.45 | 85.14,51.41 U$1.30 | PBIHEADER.19 76.18,38.84 | 15.78,87.68 v15.71,87.75 | 28.38,13.34 v28.1,13.07
  Top 0.406: IC1.13 v15.84,70.81 15.84,74.06 IC1.12 | IC2.12 16.78,59.45 15.94,58.62 v15.94,56.08 15.94,54.55 16.88,53.62 IC2.13 | IC3.12 16.83,45.28 15.94,44.39 v15.94,42.36 15.94,40.33 16.83,39.44 IC3.13 | IC4.12 16.7,31.94 15.94,31.19 v15.94,29.15 15.94,27.63 17.19,26.38 IC4.13 | C4.2 27.12,23.05 27.12,21.03 26.61,20.52 23.56,20.52 21.02,23.06 21.09,23.13 IC4.19 | IC4.23 IC4.22 IC4.21 IC4.20 IC4.19 | IC4.19 IC4.18 IC4.17 IC4.16 19.14,24.73 v18.99,24.58 | C1.2 27.5,64.84 v29.15,63.19 | C2.2 27.5,49.09 v29.15,47.95 | C3.2 27.12,36.26 v26.1,37.28 | IC2.1 24.9,59.45 v25.09,59.63 | IC1.1 24.7,75 v25.09,75.38 | IC3.1 24.45,45.28 v25.59,45.92 | IC4.1 25.85,31.94 v26.1,31.69 | PBIHEADER.1 85.14,15.85 | U$1.45 76.18,71.86 | PBIHEADER.29 85.14,51.41 | 76.18,38.84 U$1.19 | R_RD5.1 15.78,87.68 | R_RD4.1 28.38,13.34
  Bottom 0.203: U$1.50 79.38,76.94 | 78.84,72.34 78.84,73.15 | U$1.10 79.79,26.14 78.84,25.2 | 78.16,26.14 76.81,24.79 74.78,24.79 73.56,26.01 | 78.57,66.78 77.22,65.43 74.73,65.43 PBIHEADER.42 | 76.18,51.54 PBIHEADER.29 78.72,54.08 | v15.71,87.75 14.08,87.75 | v28.1,13.07 26.07,13.07
  Bottom 0.254: v15.84,70.81 15.84,72.03
  Bottom 0.406: v15.94,56.08 15.94,55.06 | v15.94,42.36 15.94,41.35 | v15.94,29.15 15.94,27.63 | v18.99,24.58 18.48,24.07 | v29.15,63.19 30.17,62.17 | v29.15,47.95 29.66,47.95 30.17,47.44 | v26.1,37.28 25.09,38.3 | v25.09,59.63 25.59,59.63 26.1,60.14 | v25.09,75.38 26.1,75.38 | v25.59,45.92 26.1,45.92 | v26.1,31.69 27.12,31.69 27.63,32.2 | 79.38,76.94 78.84,76.4 | U$1.10 78.16,26.14 | U$1.42 78.57,66.78 | U$1.30 76.18,51.54 | U$1.32 78.72,54.08
  pour Bottom: 0.08,92.23 79.92,92.16 80.33,0.31 0.4,0.44
IRQ_N  (via drill 0.51)
  Top 0.203: U$1.35 85.14,59.03 PBIHEADER.35 75.96,59.15 74.94,60.16 73.16,60.16 60.46,72.86 | 60.46,72.86 60.21,73.12 60.21,87.59 60.46,87.85 62.75,87.85 63.76,86.83 64.53,86.83 R_IRQ.2 | 60.46,72.86 v57.41,69.81
  Top 0.254: IC4.10 18.49,30.67 20.51,28.65 28.64,28.65 30.67,26.61 32.65,26.61 EXT_GPIO.39
  Bottom 0.203: v57.41,69.81 49.29,61.69 49.29,61.43 35.82,47.97 35.06,47.97 34.3,47.21 34.3,46.45 33.28,45.43 32.52,45.43 31.76,44.67 31.76,28.41 32.78,27.4 32.78,26.38 EXT_GPIO.39
MPD_N  (via drill 0.51)
  Top 0.203: U$1.43 85.14,69.19 PBIHEADER.43 75.96,69.31 74.69,70.58 74.69,77.43 68.08,84.04 68.08,86.58 R_MPD.2 68.08,86.83 69.35,88.1 69.35,90.64 69.1,90.9 15.3,90.9 2.09,77.69 2.09,76.72 2.04,76.67 2.04,17.24 6.87,12.41 v6.87,11.9 | v8.14,13.17 26.43,13.17 37.09,23.84 37.09,28.92 35.82,30.19 35.06,30.19 33.79,28.92 33.03,28.92 EXT_GPIO.37
  Top 0.254: IC4.6 21.09,30.61 21.53,30.17 29.66,30.17 30.67,29.15 32.65,29.15 EXT_GPIO.37
  Bottom 0.203: v6.87,11.9 v8.14,13.17
N$2
  Top 0.254: DE1_GPIO.1 8.32,74.87 11.88,78.43 20.51,78.43 22.66,76.28 IC1.3
N$3
  Top 0.254: DE1_GPIO.2 11.62,74.62 14.93,77.92 20.01,77.92 22.04,75.89 22.04,75.02 IC1.4
N$4
  Top 0.254: DE1_GPIO.3 8.58,72.08 9.85,73.35 13.4,73.35 13.91,73.86 13.91,75.89 15.43,77.41 18.99,77.41 20.01,76.4 20.01,75.05 IC1.7
N$5
  Top 0.254: DE1_GPIO.4 13.66,72.08 14.42,72.84 14.42,75.38 15.94,76.91 18.48,76.91 19.41,75.98 IC1.8
N$6
  Top 0.254: DE1_GPIO.5 8.58,69.54 9.85,70.81 14.42,70.81 14.93,71.32 14.93,74.87 16.45,76.4 16.96,76.4 17.47,75.89 IC1.11
N$7
  Top 0.254: DE1_GPIO.6 12.13,69.54 13.91,67.76 16.96,67.76 17.46,68.27 IC1.14
N$8
  Top 0.254: DE1_GPIO.7 8.58,67 9.85,68.27 12.39,68.27 13.4,67.25 18.48,67.25 19.41,68.18 IC1.17
N$9
  Top 0.254: DE1_GPIO.8 12.64,67 12.89,66.75 18.99,66.75 20.06,67.82 IC1.18
N$10
  Top 0.254: DE1_GPIO.9 8.58,64.46 9.85,65.73 20.01,65.73 22.04,67.76 22.01,67.79 IC1.21
N$11
  Top 0.254: DE1_GPIO.10 20.26,64.46 22.66,66.86 IC1.22
N$12
  Top 0.254: DE1_GPIO.13 8.32,59.63 9.34,60.65 11.88,60.65 13.91,62.68 21.53,62.68 22.79,61.42 IC2.3
N$13
  Top 0.254: DE1_GPIO.14 11.62,59.38 14.42,62.17 21.02,62.17 22.14,61.06 IC2.4
N$14
  Top 0.254: DE1_GPIO.15 8.58,56.84 9.85,58.11 13.4,58.11 13.91,58.62 13.91,60.65 14.93,61.67 19.5,61.67 20.19,60.97 IC2.7
N$15
  Top 0.254: DE1_GPIO.16 13.66,56.84 14.42,57.6 14.42,60.14 15.43,61.16 18.99,61.16 19.54,60.61 IC2.8
N$16
  Top 0.254: DE1_GPIO.17 8.32,54.55 9.34,55.57 13.91,55.57 14.93,56.59 14.93,59.63 15.94,60.65 16.96,60.65 17.59,60.02
  Top 0.406: IC2.11 17.59,60.02
N$17
  Top 0.254: IC2.14 17.59,52.64 16.96,52.01 15.43,52.01 13.15,54.3 DE1_GPIO.18
N$18
  Top 0.254: DE1_GPIO.19 8.58,51.76 9.85,53.03 13.4,53.03 14.93,51.51 17.97,51.51 19.54,53.07 IC2.17
N$19
  Top 0.254: DE1_GPIO.20 13.66,51.76 14.42,51 18.48,51 20.19,52.7 IC2.18
N$20
  Top 0.254: DE1_GPIO.21 8.58,49.22 9.85,50.49 13.4,50.49 13.91,49.98 19.5,49.98 22.14,52.62 IC2.21
N$21
  Top 0.254: IC2.22 22.79,52.26 20.01,49.47 11.12,49.47 DE1_GPIO.22
N$22
  Top 0.254: DE1_GPIO.23 8.58,46.68 9.85,47.95 12.39,47.95 13.4,48.97 21.53,48.97 22.92,47.58 IC3.3
N$23
  Top 0.254: DE1_GPIO.24 12.13,46.68 13.91,48.46 21.02,48.46 22.27,47.21 IC3.4
N$24
  Top 0.254: DE1_GPIO.25 8.58,44.14 9.85,45.41 11.88,45.41 14.42,47.95 18.99,47.95 20.32,46.62 IC3.7
N$25
  Top 0.254: DE1_GPIO.26 11.62,44.14 14.93,47.44 18.48,47.44 19.67,46.26 IC3.8
N$26
  Top 0.254: DE1_GPIO.27 8.58,41.6 9.85,42.87 11.37,42.87 15.43,46.93 16.96,46.93 17.72,46.18 IC3.11
N$27
  Top 0.254: DE1_GPIO.28 12.64,41.6 15.94,38.3 17.47,38.3 17.72,38.55 IC3.14
N$28
  Top 0.254: DE1_GPIO.31 8.58,36.52 9.85,37.79 18.48,37.79 19.67,38.97 IC3.17
N$29
  Top 0.254: IC3.18 20.32,38.61 18.99,37.28 11.62,37.28 DE1_GPIO.32
N$30
  Top 0.254: DE1_GPIO.33 8.58,33.98 9.85,35.25 11.88,35.25 13.4,36.77 21.02,36.77 22.27,38.02 IC3.21
N$31
  Top 0.254: DE1_GPIO.34 12.13,33.98 14.42,36.27 21.53,36.27 22.92,37.65 IC3.22
N$32
  Top 0.254: DE1_GPIO.37 8.58,28.9 9.85,30.17 12.89,30.17 13.91,31.19 13.91,32.71 15.43,34.23 19.5,34.23 20.44,33.29 IC4.7
N$33
  Top 0.254: DE1_GPIO.35 8.58,31.44 9.85,32.71 11.88,32.71 14.42,35.25 21.02,35.25 23.04,33.23 IC4.3
N$34
  Top 0.254: DE1_GPIO.36 11.62,31.44 14.93,34.74 20.51,34.74 22.39,32.86 IC4.4
N$35
  Top 0.254: DE1_GPIO.38 13.66,28.9 14.42,29.66 14.42,32.2 15.94,33.73 18.99,33.73 19.79,32.92 IC4.8
N$36
  Top 0.254: DE1_GPIO.39 8.58,26.36 9.85,27.63 13.4,27.63 14.93,29.15 14.93,31.69 16.45,33.22 17.47,33.22 17.84,32.84 IC4.11
N$37
  Top 0.254: DE1_GPIO.40 14.67,26.36 16.45,24.58 16.96,24.58 17.84,25.47 IC4.14
PHI2  (via drill 0.51)
  Top 0.203: 21.36,74.23 21.53,74.06 25.19,74.06 25.59,74.47 | U$1.31 85.14,53.95 PBIHEADER.31 76,54.05 75.18,54.05 74.17,55.07 56.08,55.07 55.88,54.86 55.27,54.86 52.63,57.51 v52.63,58.73
  Top 0.254: IC1.5 21.36,74.23 | 25.59,74.47 30.47,74.47 31.69,73.25 34.08,73.25 EXT_GPIO.2 37.02,74.62 J1.S
  Bottom 0.203: v52.63,58.73 50.39,60.96 J1.S
RAS_N
  Bottom 0.203: PBIHEADER.44 73.51,69.14 74.78,67.87 78.03,67.87 79.25,69.09 85.04,69.09 U$1.44
RD4  (via drill 0.6)
  Top 0.203: IC3.16 19.02,40.15 20.69,41.92 27.6,41.92 EXT_GPIO.31
  Top 0.254: EXT_GPIO.31 33.57,36.52 34.74,37.69 37.79,37.69 49.77,25.7 50.38,25.7 J1.A | v49.54,19.27 39.31,19.27 R_RD4.2
  Bottom 0.254: J1.A 50.56,25.53 50.56,20.28 v49.54,19.27
RD5  (via drill 0.6)
  Top 0.203: 20.71,74.07 21.12,73.65 29.25,73.65
  Top 0.254: IC1.6 20.71,74.07 | 29.25,73.65 30.88,72.03 32.86,72.03 EXT_GPIO.3 33.77,72.08 35.14,73.45 36.46,73.45 49.88,60.04 54.65,60.04 55.57,58.72 J1.14 | R_RD5.2 27.76,87.68 v30.03,85.41
  Bottom 0.254: v30.03,85.41 30.03,72.87 30.47,72.43 32.55,72.43 EXT_GPIO.3
RDY_N
  Bottom 0.203: PBIHEADER.36 73.51,58.98 74.78,57.71 77.62,57.71 78.84,58.93 85.04,58.93 U$1.36
REF_N  (via drill 0.51)
  Top 0.203: 61.73,81.5 61.73,72.61 70.11,64.23 73.42,64.23 PBIHEADER.40 | 61.73,81.5 61.73,86.58 R_REF.2 | v47.25,87.09 45.98,87.09 43.44,84.55 13.22,84.55 13.17,84.49 10.32,84.49 5.34,79.52 5.34,16.22 6.87,14.7 27.19,14.7 36.59,24.09 36.59,26.89 35.06,28.41 EXT_GPIO.38 | v48.78,85.56 59.45,85.56 59.7,85.82 59.7,87.85 60.21,88.36 65.29,88.36 66.05,87.59 66.05,85.82 61.73,81.5
  Top 0.254: IC4.9 19.14,31.03 20.51,29.66 29.15,29.66 31.18,27.63 34.18,27.63 EXT_GPIO.38
  Bottom 0.203: PBIHEADER.40 73.66,64.11 74.78,62.99 78.84,62.99 80.06,64.21 85.24,64.21 U$1.40 | v48.78,85.56 v47.25,87.09
RESERVED0
  Top 0.203: PBIHEADER.33 85.14,56.49 U$1.33
RESERVED1
  Top 0.203: PBIHEADER.37 85.14,61.57 U$1.37
RESERVED2
  Top 0.203: PBIHEADER.39 85.14,64.11 U$1.39
RESERVED3
  Top 0.203: PBIHEADER.47 85.14,74.27 U$1.47
RESERVED4
  Bottom 0.203: PBIHEADER.48 73.66,74.27 74.94,75.55 77.38,75.55 78.6,74.33 85.21,74.33 U$1.48
RST_N  (via drill 0.51)
  Top 0.203: EXT_GPIO.40 35.32,26.13 34.3,25.11 31.51,25.11 29.47,27.14 19.06,27.14 18.55,26.63 18.55,26.13 IC4.15 18.55,25.87 18.55,25.36 17.28,24.09 8.9,24.09 7.12,25.87 7.12,37.05 7.88,37.81 8.9,37.81 9.66,38.57 9.66,39.33 8.65,40.35 7.88,40.35 5.85,42.38 5.85,78.91 11.03,84.09 13.42,84.09 13.47,84.04 v44.21,84.04 | v45.73,82.51 45.73,80.23 60.97,64.99 65.03,64.99 73.42,56.61 PBIHEADER.34
  Bottom 0.203: PBIHEADER.34 73.56,56.49 74.78,55.27 77.62,55.27 78.84,56.49 85.14,56.49 U$1.34 | v45.73,82.51 v44.21,84.04
RW_N  (via drill 0.6)
  Top 0.203: 18.76,73.98 19.5,73.25 28.03,73.25 30.47,70.81 | PBIHEADER.46 70.31,71.73 67.42,68.84 v67.42,68.14 | 49.12,59.48 49.17,59.54 53.04,59.54 55.07,57.51 56.79,57.51 v63.26,63.97
  Top 0.254: IC1.9 18.76,73.98 | 30.47,70.81 34.18,70.81 EXT_GPIO.4 36.52,72.08 49.12,59.48 49.77,58.82 50.28,58.82 J1.R
  Bottom 0.203: PBIHEADER.46 73.51,71.58 74.78,70.31 77.62,70.31 78.84,71.53 84.94,71.53 U$1.46 | v63.26,63.97 v67.42,68.14
S4_N
  Top 0.203: IC3.19 20.97,40.58 | 20.97,40.58 | 20.97,40.58 21.8,41.42 26.03,41.42 32.2,35.25
  Top 0.254: 32.2,35.25 34.18,35.25 EXT_GPIO.32 36.72,36.52 50.59,22.65 52.62,22.65 J1.1
S5_N
  Top 0.203: 18.76,71.29 19.09,71.62 26,71.62 30.47,67.15
  Top 0.254: IC1.16 18.76,71.29 | 30.47,67.15 32.76,67.15 EXT_GPIO.7 33.77,67 34.94,68.17 35.96,68.17 39.41,64.71 39.41,62.68 49.77,52.32 54.35,52.32 J1.12

### Text on the board
tNames: DE1 Atari XL Cartridge/PBI board V1.1 / (c) 2015 Mark Watson and Matthias Reichl